# Altium schematic sheet 47uF Cap.schdoc
size 127 x 101 mm
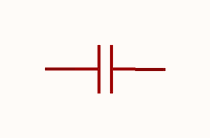
[diagram p0: 47uF Cap.schdoc]

## Parts
C?  47uF  [C1206]  (value not drawn)

## Nets

Not connected (* = marked no-connect by the designer): C? 1 2

## Library data of the parts
C? = C1206B476M016T: Manufacturer: IHHEC(禾伸堂); Add into BOM: yes; Tolerance: ±20%; Symbol: C1206B476M016T; Device: C1206B476M016T; LCSC Part Name: 47uF ±20% 16V; Supplier Part: C607993; Manufacturer Part: C1206B476M016T; Supplier Footprint: 1206; JLCPCB Part Class: Extended Part; Datasheet: https://atta.szlcsc.com/upload/public/pdf/source/20190313/C374174_331C86E4A68CC9C732DA87186AAF7F8A.pdf; Supplier: LCSC; Convert to PCB: yes; Value: 47uF